# Altium schematic sheet SCH_05_WCT_RLD.SchDoc
size A4; SheetNumber: 10; SheetTotal: 14; SPICEModelCacheSEOKWNHP: <root> / <DocumentId>SEOKWNHP</DocumentId> / </root>
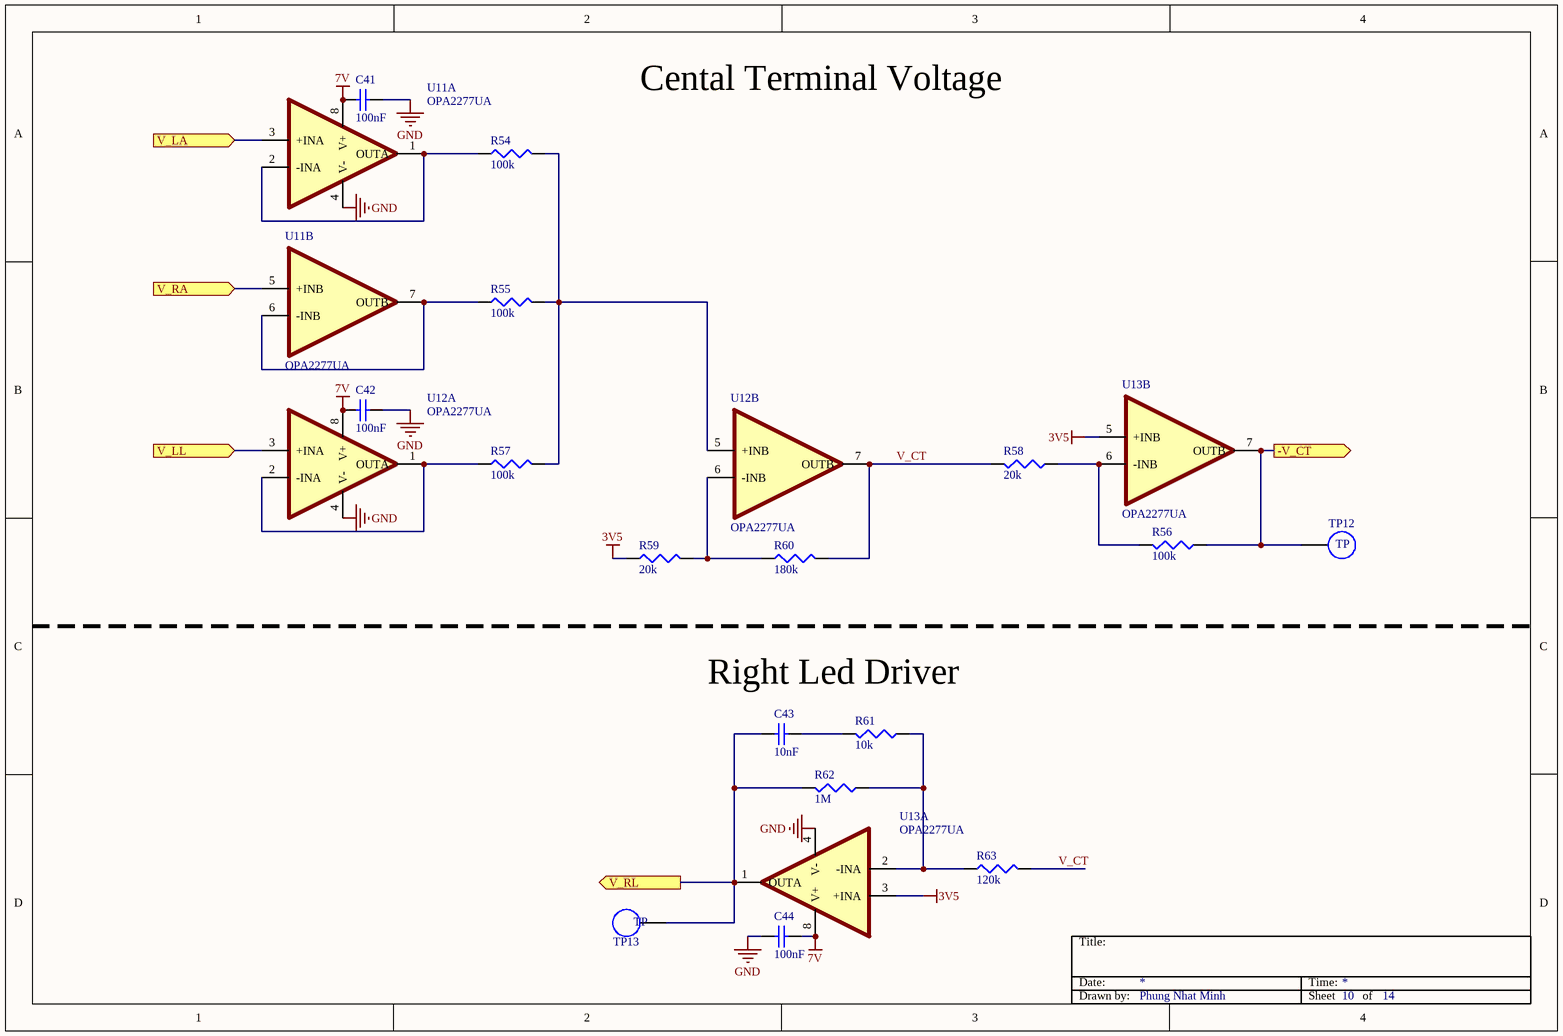
[diagram p0: SCH_05_WCT_RLD.SchDoc]

## Parts
C41  100nF  [WCAP-CSGP_0603_L1.6W0.8H0.8_Reflow]
C42  100nF  [WCAP-CSGP_0603_L1.6W0.8H0.8_Reflow]
C43  10nF  [WCAP-CSGP_0603_L1.6W0.8H0.8_Reflow]
C44  100nF  [WCAP-CSGP_0603_L1.6W0.8H0.8_Reflow]
R54  100k  [WRIS-PSMB_0603_L1.6W0.8H0.35]
R55  100k  [WRIS-PSMB_0603_L1.6W0.8H0.35]
R56  100k  [WRIS-PSMB_0603_L1.6W0.8H0.35]
R57  100k  [WRIS-PSMB_0603_L1.6W0.8H0.35]
R58  20k  [WRIS-PSMB_0603_L1.6W0.8H0.35]
R59  20k  [WRIS-PSMB_0603_L1.6W0.8H0.35]
R60  180k  [WRIS-PSMB_0603_L1.6W0.8H0.35]
R61  10k  [WRIS-PSMB_0603_L1.6W0.8H0.35]
R62  1M  [WRIS-PSMB_0603_L1.6W0.8H0.35]
R63  120k  [WRIS-PSMB_0603_L1.6W0.8H0.35]
TP12  Pad_Test_Point  [Pad_Test_Point]  (value not drawn)
TP13  Pad_Test_Point  [Pad_Test_Point]  (value not drawn)
U11  OPA2277UA  [SOIC127P599X175-8N]  (parts A,B of 2)
U12  OPA2277UA  [SOIC127P599X175-8N]  (parts A,B of 2)
U13  OPA2277UA  [SOIC127P599X175-8N]  (parts A,B of 2)

## Ports
-V_CT (out, see Schematic_Top[2B], SCH_06_Analog_Mux[2B]), V_LA (in, see Schematic_Top[1B], SCH_02_Electrodes[2A], SCH_03_Instrumentation_Amplifier[1A]), V_LL (in, see Schematic_Top[1B], SCH_02_Electrodes[2B], SCH_03_Instrumentation_Amplifier[1A]), V_RA (in, see Schematic_Top[1B], SCH_02_Electrodes[2A], SCH_03_Instrumentation_Amplifier[1A]), V_RL (out, see Schematic_Top[1B], SCH_02_Electrodes[2C])

## Nets
3V5: R59.1 U13.3(+INA) U13.5(+INB)
7V: C41.2 C42.2 C44.2 U11.8(V+) U12.8(V+) U13.8(V+)
GND: C41.1 C42.1 C44.1 U11.4(V-) U12.4(V-) U13.4(V-)
-V_CT: R56.2 TP12.1 U13.7(OUTB) ; port -V_CT
V_CT: R58.1 R60.2 R63.2 U12.7(OUTB)
V_LA: U11.3(+INA) ; port V_LA
V_LL: U12.3(+INA) ; port V_LL
V_RA: U11.5(+INB) ; port V_RA
V_RL: C43.2 R62.2 TP13.1 U13.1(OUTA) ; port V_RL
NetC43_1: C43.1 R61.2
NetR54_1: R54.1 U11.1(OUTA) U11.2(-INA)
NetR54_2: R54.2 R55.2 R57.2 U12.5(+INB)
NetR55_1: R55.1 U11.6(-INB) U11.7(OUTB)
NetR56_1: R56.1 R58.2 U13.6(-INB)
NetR57_1: R57.1 U12.1(OUTA) U12.2(-INA)
NetR59_2: R59.2 R60.1 U12.6(-INB)
NetR61_1: R61.1 R62.1 R63.1 U13.2(-INA)

## Notes on the sheet
- Cental Terminal Voltage
- Right Led Driver
- Title:
- Date:
- Time:
- Drawn by:
- Phung Nhat Minh
- Sheet
- of
- (in symbol Pad_Test_Point) TP

## Library data of the parts
C41 C42 C44 = 885012206095: WCAP-CSGP Multilayer Ceramic Chip Capacitor, General Purpose, size 0603, X7R, 100nF, 50VDC; Manufacturer: Wurth Elektronik; Case/Size Code: 0603; Capacitance Tolerance: +/-10%; Dissipation Factor: 3%; Insulation Resistance: 5GOhm; Rated Voltage (DC): 50V; Technical Reference: X7R0603104K050DFCT10000; Manufacturer Part Number: 885012206095; Category: Multilayer Ceramic Chip Capacitors; Match Code: WCAP-CSGP; ComponentLink1Description: Website Link; ComponentLink1URL: https://www.we-online.com/redexpert/article/885012206095?ad; ComponentLink2Description: Datasheet Link; ComponentLink2URL: https://www.we-online.com/redexpert/spec/885012206095?ad; Mount: Surface Mount; Operating Temperature Max: 125°C; Operating Temperature Min: -55°C; Packaging: Tape and Reel; Length: 1.6mm; Width: 0.8mm; Height: 0.8mm; Capacitance: 100nF; Ceramic Type: X7R
C43 = 885012206089: WCAP-CSGP Multilayer Ceramic Chip Capacitor, General Purpose, size 0603, X7R, 10nF, 50VDC; Manufacturer: Wurth Elektronik; Case/Size Code: 0603; Capacitance Tolerance: +/-10%; Dissipation Factor: 2.5%; Insulation Resistance: 10GOhm; Rated Voltage (DC): 50V; Technical Reference: X7R0603103K050DFCT10000; Manufacturer Part Number: 885012206089; Category: Multilayer Ceramic Chip Capacitors; Match Code: WCAP-CSGP; ComponentLink1Description: Website Link; ComponentLink1URL: https://www.we-online.com/redexpert/article/885012206089?ad; ComponentLink2Description: Datasheet Link; ComponentLink2URL: https://www.we-online.com/redexpert/spec/885012206089?ad; Mount: Surface Mount; Operating Temperature Max: 125°C; Operating Temperature Min: -55°C; Packaging: Tape and Reel; Length: 1.6mm; Width: 0.8mm; Height: 0.8mm; Capacitance: 10nF; Ceramic Type: X7R
R54-R63 = 580060716001: WRIS-PSMB Metal Plate Resistor, SMT, size 0603, 0.33W, 5mΩ, +/-1%; Manufacturer: Wurth Elektronik; Case/Size Code: 0603; Rated Current: 8.12A; Technical Reference: MB0603R005F103KAATP0000; Temperature Coefficient of Resistance: +/-100ppm/°C; Manufacturer Part Number: 580060716001; Category: Metal Plate Resistors; Match Code: WRIS-PSMB; ComponentLink1Description: Website Link; ComponentLink1URL: https://www.we-online.com/redexpert/article/580060716001?ad; ComponentLink2Description: Datasheet Link; ComponentLink2URL: https://www.we-online.com/redexpert/spec/580060716001?ad; Mount: Surface Mount; Operating Temperature Max: 155°C; Operating Temperature Min: -55°C; Packaging: Tape and Reel; Length: 1.6mm; Width: 0.8mm; Height: 0.35mm; Rated Power: 0.33W; Resistance: 5mΩ; Resistance Tolerance: +/-1%
U11-U13 = OPA2277UA: MP: OPA2227UA; Package: None; Price: None; Value: *; Availability: Unavailable